# Altium schematic sheet LPCB235 - HE THROTTLES.SchDoc
size A3; Address1: Factory 10; Address2: 9-13 Dingley Avenue, Dandeong, VICTORIA 3175, AUSTRALIA; DocumentNumber: 12; Revision: 1; SheetNumber: 12; SheetTotal: 37; Lockie__PCB_SUB_ASSEMBLY: HE Throttle Channels; Lockie__PCB_ASSEMBLY: FCU PCB; Lockie__LDL: LPCB235; Lockie__PCB_DESCRIPTION: Flight Control Unit
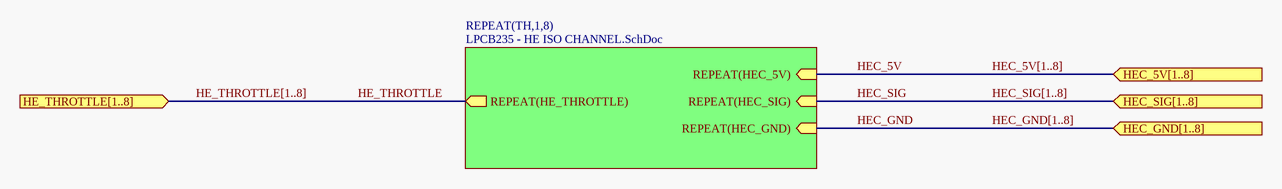
[diagram p0: LPCB235 - HE THROTTLES.SchDoc]

## Sub-sheets
REPEAT(TH,1,8) = LPCB235 - HE ISO CHANNEL.SchDoc: REPEAT(HE_THROTTLE) (out), REPEAT(HEC_5V) (in), REPEAT(HEC_GND) (in), REPEAT(HEC_SIG) (in)

## Ports
HE_THROTTLE[1..8] (in), HEC_5V[1..8] (in), HEC_GND[1..8] (in), HEC_SIG[1..8] (in)

## Nets
HE_THROTTLE: sheet REPEAT(TH,1,8)/REPEAT(HE_THROTTLE)
HEC_5V: sheet REPEAT(TH,1,8)/REPEAT(HEC_5V)
HEC_GND: sheet REPEAT(TH,1,8)/REPEAT(HEC_GND)
HEC_SIG: sheet REPEAT(TH,1,8)/REPEAT(HEC_SIG)

## Buses and harness runs
bus HE_THROTTLE[1..8] = port HE_THROTTLE[1..8]
bus HEC_5V[1..8] = port HEC_5V[1..8]
bus HEC_GND[1..8] = port HEC_GND[1..8]
bus HEC_SIG[1..8] = port HEC_SIG[1..8]

## Notes on the sheet
- PCB COMPONENT DESCRIPTION
- LDL NUMBER
- Assembly Details
- Size
- Drawing File Name
- Revision
- http://rloop.org
- Scale
- A3
- Sheet Details
- N.T.S
- Sheet:
- Of: